# EAGLE design z80test (EAGLE 7.2.0)
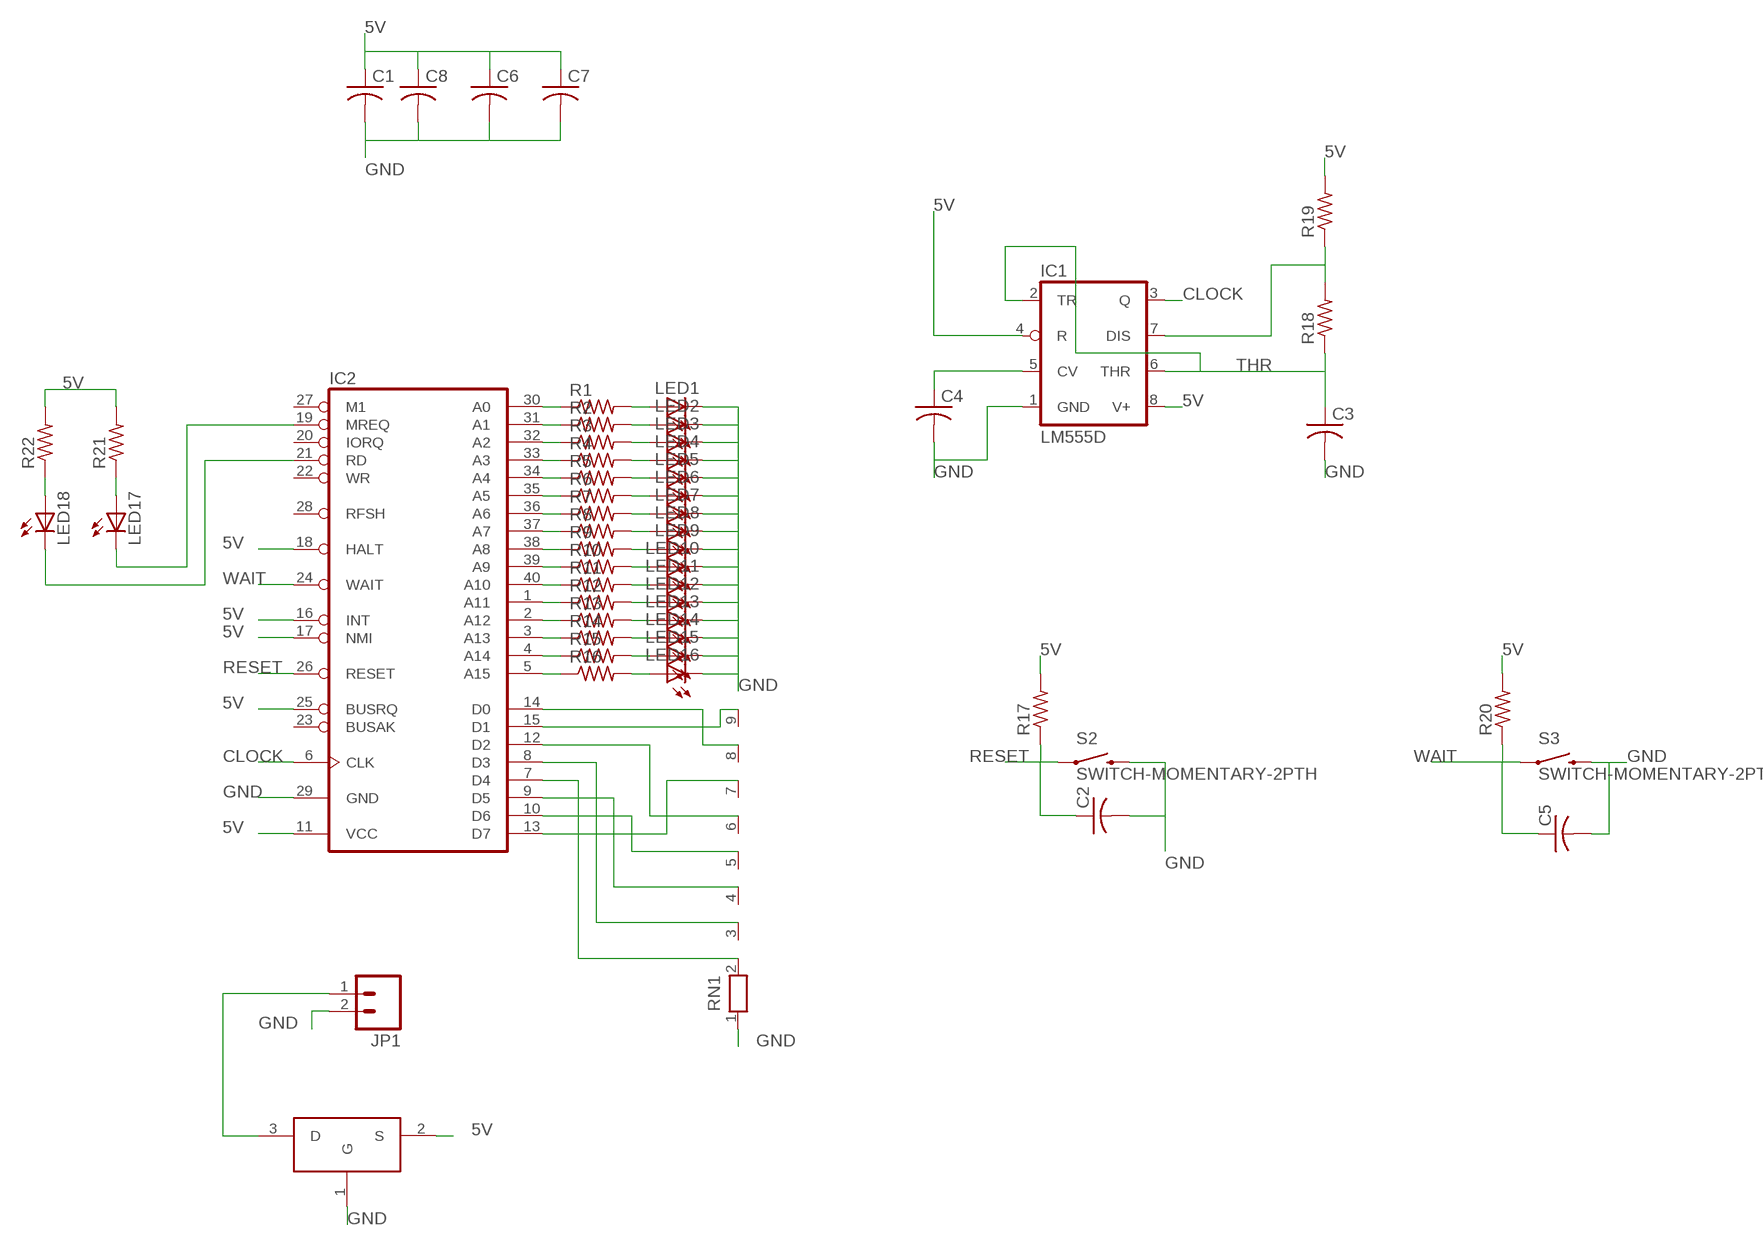
[diagram p0: schematic, sheet 1]

## Parts
C1  C-USC0805K  [C0805K]
C2  C-USC0603  [C0603]
C3  C-USC0603  [C0603]
C4  C-USC0603  [C0603]
C5  C-USC0603  [C0603]
C6  C-USC0603  [C0603]
C7  C-USC0603  [C0603]
C8  C-USC0603  [C0603]
IC1  LM555D  [SO08]
IC2  Z80CPU  [DIL40]
JP1  M02PTH  [1X02]
LED1  LEDCHIPLED_0805  [CHIPLED_0805]
LED2  LEDCHIPLED_0805  [CHIPLED_0805]
LED3  LEDCHIPLED_0805  [CHIPLED_0805]
LED4  LEDCHIPLED_0805  [CHIPLED_0805]
LED5  LEDCHIPLED_0805  [CHIPLED_0805]
LED6  LEDCHIPLED_0805  [CHIPLED_0805]
LED7  LEDCHIPLED_0805  [CHIPLED_0805]
LED8  LEDCHIPLED_0805  [CHIPLED_0805]
LED9  LEDCHIPLED_0805  [CHIPLED_0805]
LED10  LEDCHIPLED_0805  [CHIPLED_0805]
LED11  LEDCHIPLED_0805  [CHIPLED_0805]
LED12  LEDCHIPLED_0805  [CHIPLED_0805]
LED13  LEDCHIPLED_0805  [CHIPLED_0805]
LED14  LEDCHIPLED_0805  [CHIPLED_0805]
LED15  LEDCHIPLED_0805  [CHIPLED_0805]
LED16  LEDCHIPLED_0805  [CHIPLED_0805]
LED17  LEDCHIPLED_0805  [CHIPLED_0805]
LED18  LEDCHIPLED_0805  [CHIPLED_0805]
R1  R-US_R0603  [R0603]
R2  R-US_R0603  [R0603]
R3  R-US_R0603  [R0603]
R4  R-US_R0603  [R0603]
R5  R-US_R0603  [R0603]
R6  R-US_R0603  [R0603]
R7  R-US_R0603  [R0603]
R8  R-US_R0603  [R0603]
R9  R-US_R0603  [R0603]
R10  R-US_R0603  [R0603]
R11  R-US_R0603  [R0603]
R12  R-US_R0603  [R0603]
R13  R-US_R0603  [R0603]
R14  R-US_R0603  [R0603]
R15  R-US_R0603  [R0603]
R16  R-US_R0603  [R0603]
R17  R-US_R0603  [R0603]
R18  R-US_R0603  [R0603]
R19  R-US_R0603  [R0603]
R20  R-US_R0603  [R0603]
R21  R-US_R0603  [R0603]
R22  R-US_R0603  [R0603]
RN1  RN08  [RN-9]
S2  SWITCH-MOMENTARY-2PTH  [TACTILE-PTH]
S3  SWITCH-MOMENTARY-2PTH  [TACTILE-PTH]
U$1  PMOS_RP  [SOT23-3]

## Nets
5V: C1.1 C6.1 C7.1 C8.1 IC1.4(R) IC1.8(V+) IC2.11(VCC) IC2.16(INT) IC2.17(NMI) IC2.18(HALT) IC2.25(BUSRQ) R17.2 R19.2 R20.2 R21.2 R22.2 U$1.2(S)
CLOCK: IC1.3(Q) IC2.6(CLK)
GND: C1.2 C2.2 C3.2 C4.2 C5.2 C6.2 C7.2 C8.2 IC1.1(GND) IC2.29(GND) JP1.2 LED1.C LED2.C LED3.C LED4.C LED5.C LED6.C LED7.C LED8.C LED9.C LED10.C LED11.C LED12.C LED13.C LED14.C LED15.C LED16.C RN1.1 S2.3 S3.3 U$1.1(G)
JUNCTION: IC1.7(DIS) R18.2 R19.1
N$1: IC2.15(D1) RN1.9
N$2: IC2.14(D0) RN1.8
N$3: IC2.13(D7) RN1.7
N$4: IC2.12(D2) RN1.6
N$5: IC2.10(D6) RN1.5
N$6: IC2.9(D5) RN1.4
N$7: IC2.8(D3) RN1.3
N$8: IC2.7(D4) RN1.2
N$9: IC2.30(A0) R1.1
N$10: IC2.31(A1) R2.1
N$11: IC2.32(A2) R3.1
N$12: IC2.33(A3) R4.1
N$13: IC2.34(A4) R5.1
N$14: IC2.35(A5) R6.1
N$15: IC2.36(A6) R7.1
N$16: IC2.37(A7) R8.1
N$17: IC2.38(A8) R9.1
N$18: IC2.39(A9) R10.1
N$19: IC2.40(A10) R11.1
N$20: IC2.1(A11) R12.1
N$21: IC2.2(A12) R13.1
N$22: IC2.3(A13) R14.1
N$23: IC2.4(A14) R15.1
N$24: IC2.5(A15) R16.1
N$25: LED1.A R1.2
N$26: LED2.A R2.2
N$27: LED3.A R3.2
N$28: LED4.A R4.2
N$29: LED5.A R5.2
N$30: LED6.A R6.2
N$31: LED7.A R7.2
N$32: LED8.A R8.2
N$33: LED9.A R9.2
N$34: LED10.A R10.2
N$35: LED11.A R11.2
N$36: LED12.A R12.2
N$37: LED13.A R13.2
N$38: LED14.A R14.2
N$39: LED15.A R15.2
N$40: LED16.A R16.2
N$41: C4.1 IC1.5(CV)
N$42: JP1.1 U$1.3(D)
N$45: LED17.A R21.1
N$46: LED18.A R22.1
N$47: IC2.19(MREQ) LED17.C
N$48: IC2.21(RD) LED18.C
RESET: C2.1 IC2.26(RESET) R17.1 S2.1
THR: C3.1 IC1.2(TR) IC1.6(THR) R18.1
WAIT: C5.1 IC2.24(WAIT) R20.1 S3.1
Unconnected: IC2.20(IORQ) IC2.22(WR) IC2.23(BUSAK) IC2.27(M1) IC2.28(RFSH)

## Library data of the parts
C1-C8 = adafruit:C-US: CAPACITOR, American symbol
IC1 = adafruit:*555: TIMER Changed DIP package to have round (not oval) pin pads http://www.ladyada.net/library/pcb/eaglelibrary.html
IC2 = zilog:Z80CPU: Z80 FAMILY DEVICE
JP1 = SparkFun-Connectors:M02: Standard 2-pin 0.1" header. Use with - straight break away headers ( PRT-00116) - right angle break away headers (PRT-00553) - swiss pins (PRT-00743) - machine pins (PRT-00117) - female headers (PRT-00115) Molex polarized connector foot print use with: PRT-08233 with associated crimp pins and housings. 2.54_SCREWTERM for use with PRT-10571. 3.5mm Screw Terminal footprints for PRT-08084 5mm Screw Terminal footprints for use with PRT-08432
LED1-LED18 = adafruit:LED: LED OSRAM: - CHIPLED LG R971, LG N971, LY N971, LG Q971, LY Q971, LO R971, LY R971 LH N974, LH R974 LS Q976, LO Q976, LY Q976 LO Q996 - Hyper CHIPLED LW Q18S LB Q993, LB Q99A, LB R99A - SideLED LS A670, LO A670, LY A670, LG A670, LP A670 LB A673, LV A673, LT A673, LW A673 LH A674 LY A675 LS A676, LA A676, LO A676, LY A676, LW A676 LS A679, LY A679, LG A679 - Hyper Micro SIDELED® LS Y876, LA Y876, LO Y876, LY Y876 LT Y87S - SmartLED LW L88C, LW L88S LB L89C, LB L89S, LG L890 LS L89K, LO L89K, LY L89K LS L896, LA L896, LO L896, LY L896 - TOPLED LS T670, LO T670, LY T670, LG T670, LP T670 LSG T670, LSP T670, LSY T670, LOP T670, LYG T670 LG T671, LOG T671, LSG T671 LB T673, LV T673, LT T673, LW T673 LH T674 LS T676, LA T676, LO T676, LY T676, LB T676, LH T676, LSB T676, LW T676 LB T67C, LV T67C, LT T67C, LS T67K, LO T67K, LY T67K, LW E67C LS E67B, LA E67B, LO E67B, LY E67B, LB E67C, LV E67C, LT E67C LW T67C LS T679, LY T679, LG T679 LS T770, LO T770, LY T770, LG T770, LP T770 LB T773, LV T773, LT T773, LW T773 LH T774 LS E675, LA E675, LY E675, LS T675 LS T776, LA T776, LO T776, LY T776, LB T776 LHGB T686 LT T68C, LB T68C - Hyper Mini TOPLED® LB M676 - Mini TOPLED Santana® LG M470 LS M47K, LO M47K, LY M47K Source: http://www.osram.convergy.de/
R1-R22 = adafruit:R-US_: RESISTOR, American symbol
RN1 = resistor-net:RN08: RESISTOR NETWORK; OC_FARNELL: unknown; OC_NEWARK: unknown
S2 S3 = SparkFun-Electromechanical:SWITCH-MOMENTARY-2: Various NO switches- pushbuttons, reed, etc
U$1 = _CustomParts:PMOS_RP

## Board
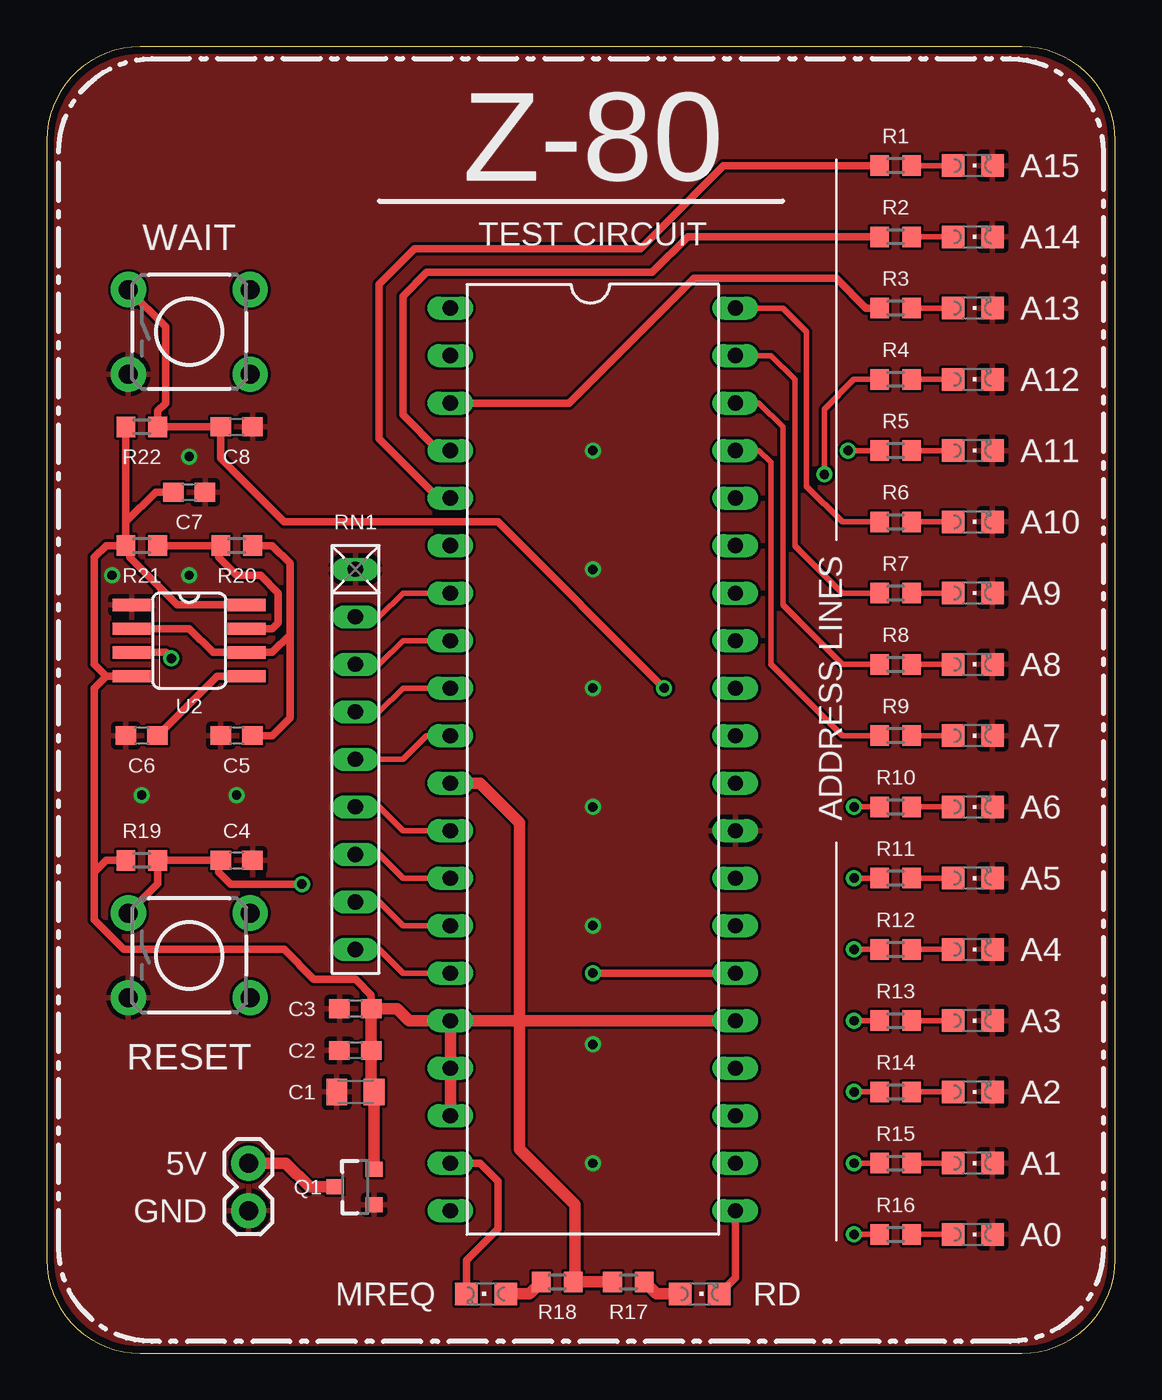
[diagram p1: board, top side]
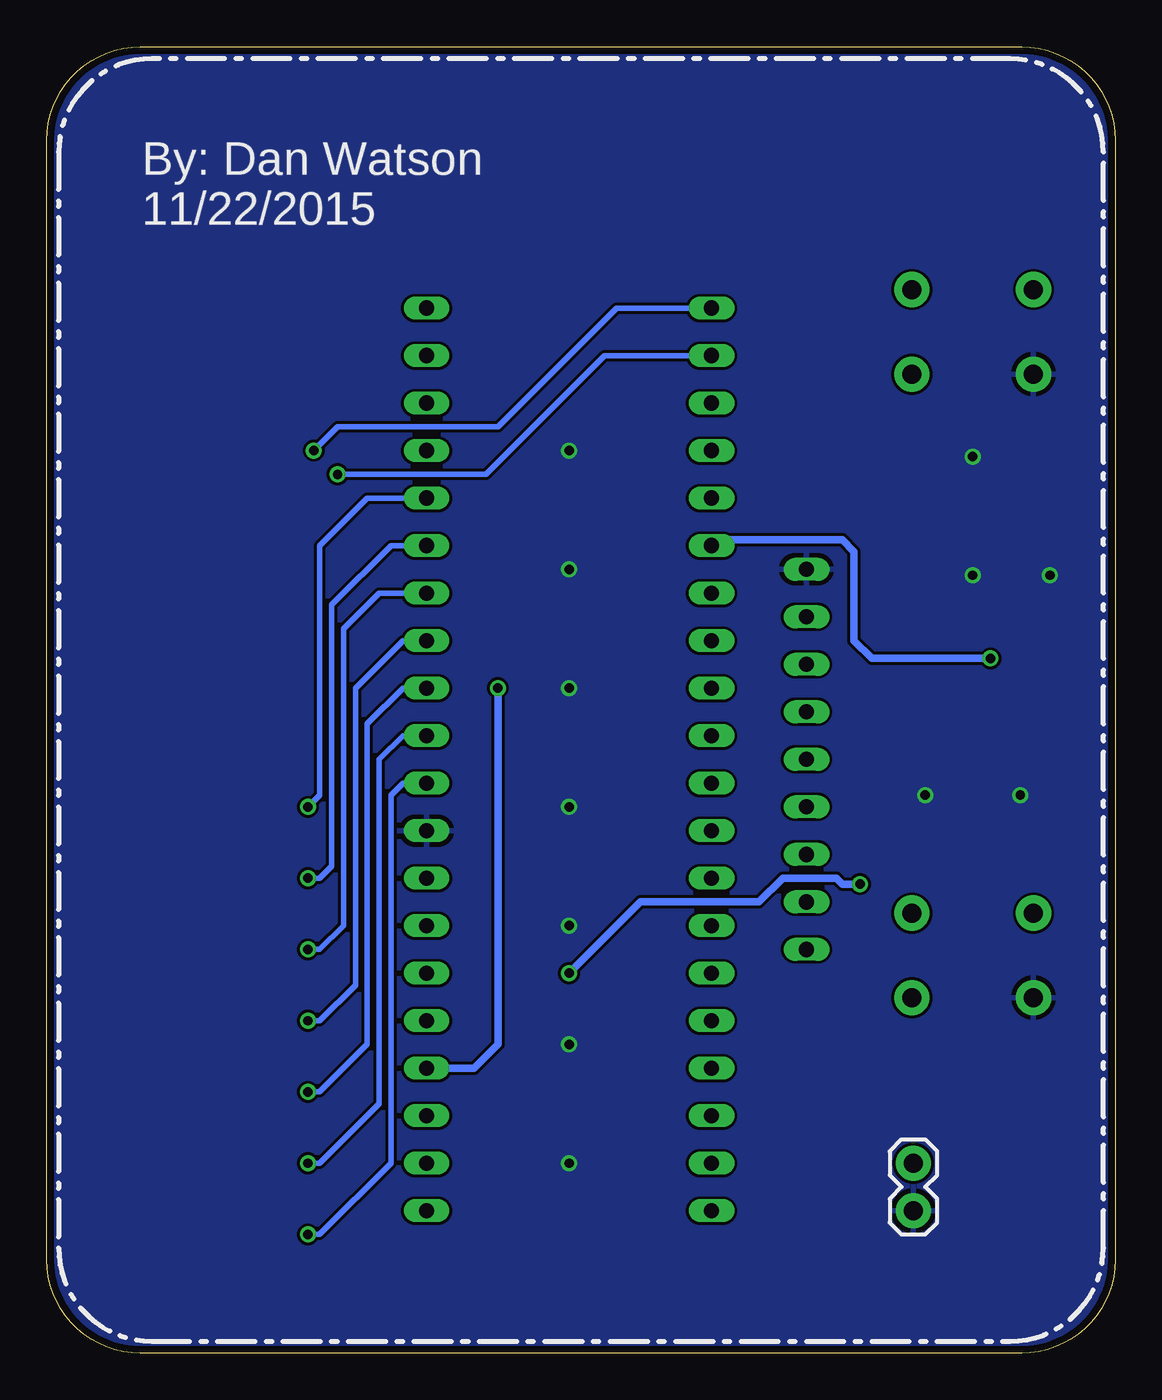
[diagram p2: board, bottom side, seen from below]

Size 57.15 x 69.85 mm. Coordinates in mm from the lower left corner, seen from the top.
Outline: 0,64.85 0,5 arc90 5,0 52.15,0 arc90 57.15,5 57.15,64.85 arc90 52.15,69.85 5,69.85 arc90 0,64.85
Copper layers (1*16): Top 0.0356mm / dielectric 1.5011mm / Bottom 0.0356mm
Design rules "oshpark-2layer *": minimum track width 6mil, minimum drill 13mil, track to track 6mil, track to pad 6mil, pad to pad 6mil, via to via 6mil, smd to smd 6mil, copper to edge 15mil, drill to drill 6mil, minimum pad ring 7mil, minimum via ring 7mil, stop-mask expansion 4mil, vias tented up to drill 20mil, thermal gap 10mil

### Footprints (pad centres in the part's own frame; a part is rotated, then mirrored left to right if it is on the bottom)
C0805K = smd 1.1 x 1.4: 1 -1,0; 2 1,0
C0603 = smd 1.1 x 1: 1 -0.85,0; 2 0.85,0
SO08 = smd 0.66 x 2.032: 1 -1.905,-3.073; 2 -0.635,-3.073; 3 0.635,-3.073; 4 1.905,-3.073; 5 1.905,3.073; 6 0.635,3.073; 7 -0.635,3.073; 8 -1.905,3.073
DIL40 = drill 0.813 long: 1 -24.13,-7.62; 2 -21.59,-7.62; 3 -19.05,-7.62; 4 -16.51,-7.62; 5 -13.97,-7.62; 6 -11.43,-7.62; 7 -8.89,-7.62; 8 -6.35,-7.62; 9 -3.81,-7.62; 10 -1.27,-7.62; 11 1.27,-7.62; 12 3.81,-7.62; 13 6.35,-7.62; 14 8.89,-7.62; 15 11.43,-7.62; 16 13.97,-7.62; 17 16.51,-7.62; 18 19.05,-7.62; 19 21.59,-7.62; 20 24.13,-7.62; 21 24.13,7.62; 22 21.59,7.62; 23 19.05,7.62; 24 16.51,7.62; 25 13.97,7.62; 26 11.43,7.62; 27 8.89,7.62; 28 6.35,7.62; 29 3.81,7.62; 30 1.27,7.62; 31 -1.27,7.62; 32 -3.81,7.62; 33 -6.35,7.62; 34 -8.89,7.62; 35 -11.43,7.62; 36 -13.97,7.62; 37 -16.51,7.62; 38 -19.05,7.62; 39 -21.59,7.62; 40 -24.13,7.62
1X02 = drill 1.016 pad 1.88: 1 0,0; 2 2.54,0
CHIPLED_0805 = smd 1.2 x 1.2: A 0,-1.05; C 0,1.05
R0603 = smd 1 x 1.1: 1 -0.85,0; 2 0.85,0
RN-9 = drill 0.813 long: 1 -10.16,0; 2 -7.62,0; 3 -5.08,0; 4 -2.54,0; 5 0,0; 6 2.54,0; 7 5.08,0; 8 7.62,0; 9 10.16,0
TACTILE-PTH = drill 1.016 pad 1.88: 1 -3.251,2.261; 2 3.251,2.261; 3 -3.251,-2.261; 4 3.251,-2.261
SOT23-3 = smd 0.8 x 0.9: 1 -0.95,-1; 2 0.95,-1; 3 0,1.1

### Placement (x,y rotation side)
C1  16.51,13.97 180 top
C2  10.16,26.35 0 top
C3  10.16,33.02 180 top
C4  5.08,33.02 180 top
C5  10.16,49.53 0 top
C6  16.51,16.19 180 top
C7  16.51,18.41 180 top
C8  7.62,46.04 0 top
IC1  7.62,38.1 270 top
IC2  29.21,31.75 270 top
JP1  10.79,10.16 270 top
LED1  49.53,6.35 270 top
LED2  49.53,10.16 270 top
LED3  49.53,13.97 270 top
LED4  49.53,17.78 270 top
LED5  49.53,21.59 270 top
LED6  49.53,25.4 270 top
LED7  49.53,29.21 270 top
LED8  49.53,33.02 270 top
LED9  49.53,36.83 270 top
LED10  49.53,40.64 270 top
LED11  49.53,44.45 270 top
LED12  49.53,48.26 270 top
LED13  49.53,52.07 270 top
LED14  49.53,55.88 270 top
LED15  49.53,59.69 270 top
LED16  49.53,63.5 270 top
LED17  23.5,3.17 90 top
LED18  34.92,3.17 270 top
R1  45.4,6.35 0 top
R2  45.4,10.16 0 top
R3  45.4,13.97 0 top
R4  45.4,17.78 0 top
R5  45.4,21.59 0 top
R6  45.4,25.4 0 top
R7  45.4,29.21 0 top
R8  45.4,33.02 0 top
R9  45.4,36.83 0 top
R10  45.4,40.64 0 top
R11  45.4,44.45 0 top
R12  45.4,48.26 0 top
R13  45.4,52.07 0 top
R14  45.4,55.88 0 top
R15  45.4,59.69 0 top
R16  45.4,63.5 0 top
R17  5.08,26.35 180 top
R18  10.16,43.18 180 top
R19  5.08,43.18 180 top
R20  5.08,49.53 180 top
R21  27.3,3.81 0 top
R22  31.11,3.81 180 top
RN1  16.51,31.75 270 top
S2  7.62,21.27 0 top
S3  7.62,54.61 0 top
U$1  16.51,8.89 90 top

### Tracks (layer width: path | path; a pad name or v marks a point on that pad's centre or on a via)
5V
  Top 0.406: IC1.8 6.99,40.01 4.45,42.55 4.45,42.97 R19.2 | R19.2 3.17,43.18 2.54,42.55 2.54,36.83 3.17,36.2 | 3.17,36.2 2.54,35.56 2.54,25.72 | 2.54,25.72 2.54,23.18 4.13,21.59 12.7,21.59 14.29,20 16.51,20 17.36,19.15 C7.1 | 3.17,36.2 IC1.4 | R20.2 4.23,44.45 | 4.23,44.45 R19.2 | 4.45,26.14 R17.2 3.17,26.35 2.54,25.72 | C8.1 5.82,46.04 4.23,44.45
  Top 0.61: 25.3,17.78 25.3,10.9 28.26,7.94 28.26,3.91 R21.2 R22.2 | 25.3,17.78 25.3,28.36 23.18,30.48 IC2.11 | IC2.18 IC2.17 IC2.16 | IC2.16 25.3,17.78 | IC2.25 25.3,17.78 | IC2.16 19.37,17.78 18.73,18.41 C7.1 C6.1 17.36,14.12 C1.1 U$1.2
CLOCK  (via drill 0.5)
  Top 0.406: IC1.3 6.35,37.47 v6.67,37.15
  Bottom 0.406: v6.67,37.15 13.02,37.15 13.97,38.1 13.97,42.86 14.61,43.5 21.27,43.5 IC2.6
GND  (via drill 0.5)
  other vias: 7.62,47.94 3.49,41.59 5.08,29.84 10.16,29.84 29.21,29.21 29.21,48.26 29.21,41.91 29.21,35.56 29.21,22.86 29.21,16.51 29.21,10.16 7.62,41.59
  pour Bottom: -7.62,73.66 -7.62,-3.81 68.58,-3.81 68.58,74.93 -7.62,74.93
  pour Top: -5.08,72.39 -5.08,-2.54 66.04,-2.54 66.04,72.39
JUNCTION
  Top 0.406: R19.1 R18.2 9.21,43.08 9.21,42.55 10.16,41.59 11.43,41.59 12.38,40.64 12.38,39.05 12.06,38.73 IC1.7
N$1
  Top 0.305: RN1.9 17.78,21.59 19.05,20.32 IC2.15
N$2
  Top 0.305: RN1.8 17.78,24.13 19.05,22.86 IC2.14
N$3
  Top 0.305: RN1.7 17.78,26.67 19.05,25.4 IC2.13
N$4
  Top 0.305: RN1.6 17.78,29.21 19.05,27.94 IC2.12
N$5
  Top 0.305: RN1.5 19.05,31.75 20.32,33.02 IC2.10
N$6
  Top 0.305: RN1.4 17.78,34.29 19.05,35.56 IC2.9
N$7
  Top 0.305: RN1.3 17.78,36.83 19.05,38.1 IC2.8
N$8
  Top 0.305: RN1.2 17.78,39.37 19.05,40.64 IC2.7
N$9  (via drill 0.5)
  Top 0.305: v43.18,6.35 R1.1
  Bottom 0.305: IC2.30 38.1,30.48 38.73,29.84 38.73,10.16 42.55,6.35 v43.18,6.35
N$10  (via drill 0.5)
  Top 0.305: v43.18,10.16 R2.1
  Bottom 0.305: IC2.31 38.1,33.02 39.37,31.75 39.37,13.34 42.55,10.16 v43.18,10.16
N$11  (via drill 0.5)
  Top 0.305: v43.18,13.97 R3.1
  Bottom 0.305: IC2.32 38.1,35.56 40.01,33.66 40.01,16.51 42.55,13.97 v43.18,13.97
N$12  (via drill 0.5)
  Top 0.305: v43.18,17.78 R4.1
  Bottom 0.305: IC2.33 38.1,38.1 40.64,35.56 40.64,19.68 42.55,17.78 v43.18,17.78
N$13  (via drill 0.5)
  Top 0.305: v43.18,21.59 R5.1
  Bottom 0.305: IC2.34 39.37,40.64 41.27,38.73 41.27,22.86 42.55,21.59 v43.18,21.59
N$14  (via drill 0.5)
  Top 0.305: v43.18,25.4 R6.1
  Bottom 0.305: IC2.35 38.73,43.18 41.91,40.01 41.91,26.04 42.55,25.4 v43.18,25.4
N$15  (via drill 0.5)
  Top 0.305: v43.18,29.21 R7.1
  Bottom 0.305: IC2.36 40.01,45.72 42.55,43.18 42.55,29.84 v43.18,29.21
N$16
  Top 0.305: IC2.37 38.1,48.26 38.73,47.62 38.73,36.83 42.55,33.02 R8.1
N$17
  Top 0.305: IC2.38 38.1,50.8 39.37,49.53 39.37,40.01 42.55,36.83 R9.1
N$18
  Top 0.305: IC2.39 38.73,53.34 40.01,52.07 40.01,43.18 42.55,40.64 R10.1
N$19
  Top 0.305: IC2.40 39.37,55.88 40.64,54.61 40.64,46.35 42.55,44.45 R11.1
N$20  (via drill 0.5)
  Top 0.305: v42.86,48.26 R12.1
  Bottom 0.305: IC2.1 26.67,55.88 33.02,49.53 41.59,49.53 v42.86,48.26
N$21  (via drill 0.5)
  Top 0.305: R13.1 43.18,52.07 41.59,50.48 v41.59,46.99
  Bottom 0.305: IC2.2 27.3,53.34 33.66,46.99 v41.59,46.99
N$22
  Top 0.406: IC2.3 27.94,50.8 34.61,57.47 42.23,57.47 43.81,55.88 R14.1
N$23
  Top 0.406: IC2.4 20.95,48.26 19.05,50.16 19.05,56.52 20.32,57.78 32.38,57.78 34.29,59.69 R15.1
N$24
  Top 0.406: IC2.5 20.95,45.72 17.78,48.9 17.78,57.15 19.68,59.05 31.75,59.05 36.2,63.5 R16.1
N$25
  Top 0.305: R1.2 LED1.A
N$26
  Top 0.305: R2.2 LED2.A
N$27
  Top 0.305: R3.2 LED3.A
N$28
  Top 0.305: R4.2 LED4.A
N$29
  Top 0.305: R5.2 LED5.A
N$30
  Top 0.305: R6.2 LED6.A
N$31
  Top 0.305: R7.2 LED7.A
N$32
  Top 0.305: R8.2 LED8.A
N$33
  Top 0.305: R9.2 LED9.A
N$34
  Top 0.305: R10.2 LED10.A
N$35
  Top 0.305: R11.2 LED11.A
N$36
  Top 0.305: R12.2 LED12.A
N$37
  Top 0.305: R13.2 LED13.A
N$38
  Top 0.305: R14.2 LED14.A
N$39
  Top 0.305: R15.2 LED15.A
N$40
  Top 0.305: R16.2 LED16.A
N$41
  Top 0.406: IC1.5 9.11,36.2 C4.1
N$42
  Top 0.61: JP1.1 12.79,10.16 14.06,8.89 U$1.3
N$45
  Top 0.61: LED17.A 25.82,3.17 R21.1
N$46
  Top 0.61: LED18.A 32.6,3.17 R22.1
N$47
  Top 0.406: LED17.C 22.45,4.98 24.13,6.67 24.13,9.21 23.18,10.16 IC2.19
N$48
  Top 0.406: IC2.21 36.83,4.03 LED18.C
RESET  (via drill 0.5)
  Top 0.406: v13.65,25.08 9.84,25.08 9.21,25.72 9.21,26.25 C2.1 R17.1 5.93,25.09 S2.1 | IC2.26 v29.21,20.32
  Bottom 0.406: v13.65,25.08 14.61,25.08 14.92,25.4 17.78,25.4 19.05,24.13 25.4,24.13 v29.21,20.32
THR
  Top 0.406: R18.1 12.06,43.18 13.02,42.23 13.02,38.42 | 13.02,38.42 12.06,37.47 IC1.6 8.89,37.47 7.62,38.73 IC1.2 | C3.1 12.06,33.02 13.02,33.97 13.02,38.42
WAIT  (via drill 0.5)
  Top 0.406: S3.1 6.35,54.89 6.35,50.8 5.93,50.38 R20.1 C5.1 9.31,47.84 12.7,44.45 24.13,44.45 v33.02,35.56
  Bottom 0.406: v33.02,35.56 33.02,16.51 34.29,15.24 IC2.24

### Text on the board
tNames: Z-80 | R1 | A15 | R2 | WAIT | TEST CIRCUIT | A14 | R3 | A13 | R4 | A12 | R5 | R22 | C8 | A11 | R6 | C7 | RN1 | A10 | R21 | R20 | R7 | A9 | R8 | A8 | ADDRESS LINES | U2 | R9 | A7 | C6 | C5 | R10 | A6 | R19 | C4 | R11 | A5 | R12 | A4 | R13 | C3 | A3 | RESET | C2 | R14 | C1 | A2 | R15 | 5V | A1 | Q1 | GND | R16 | A0 | MREQ | RD | R18 | R17
bNames: By: Dan Watson / 11/22/2015